# EAGLE schematic led_analog_watch_mvmt_v1_3 (EAGLE 6.2)
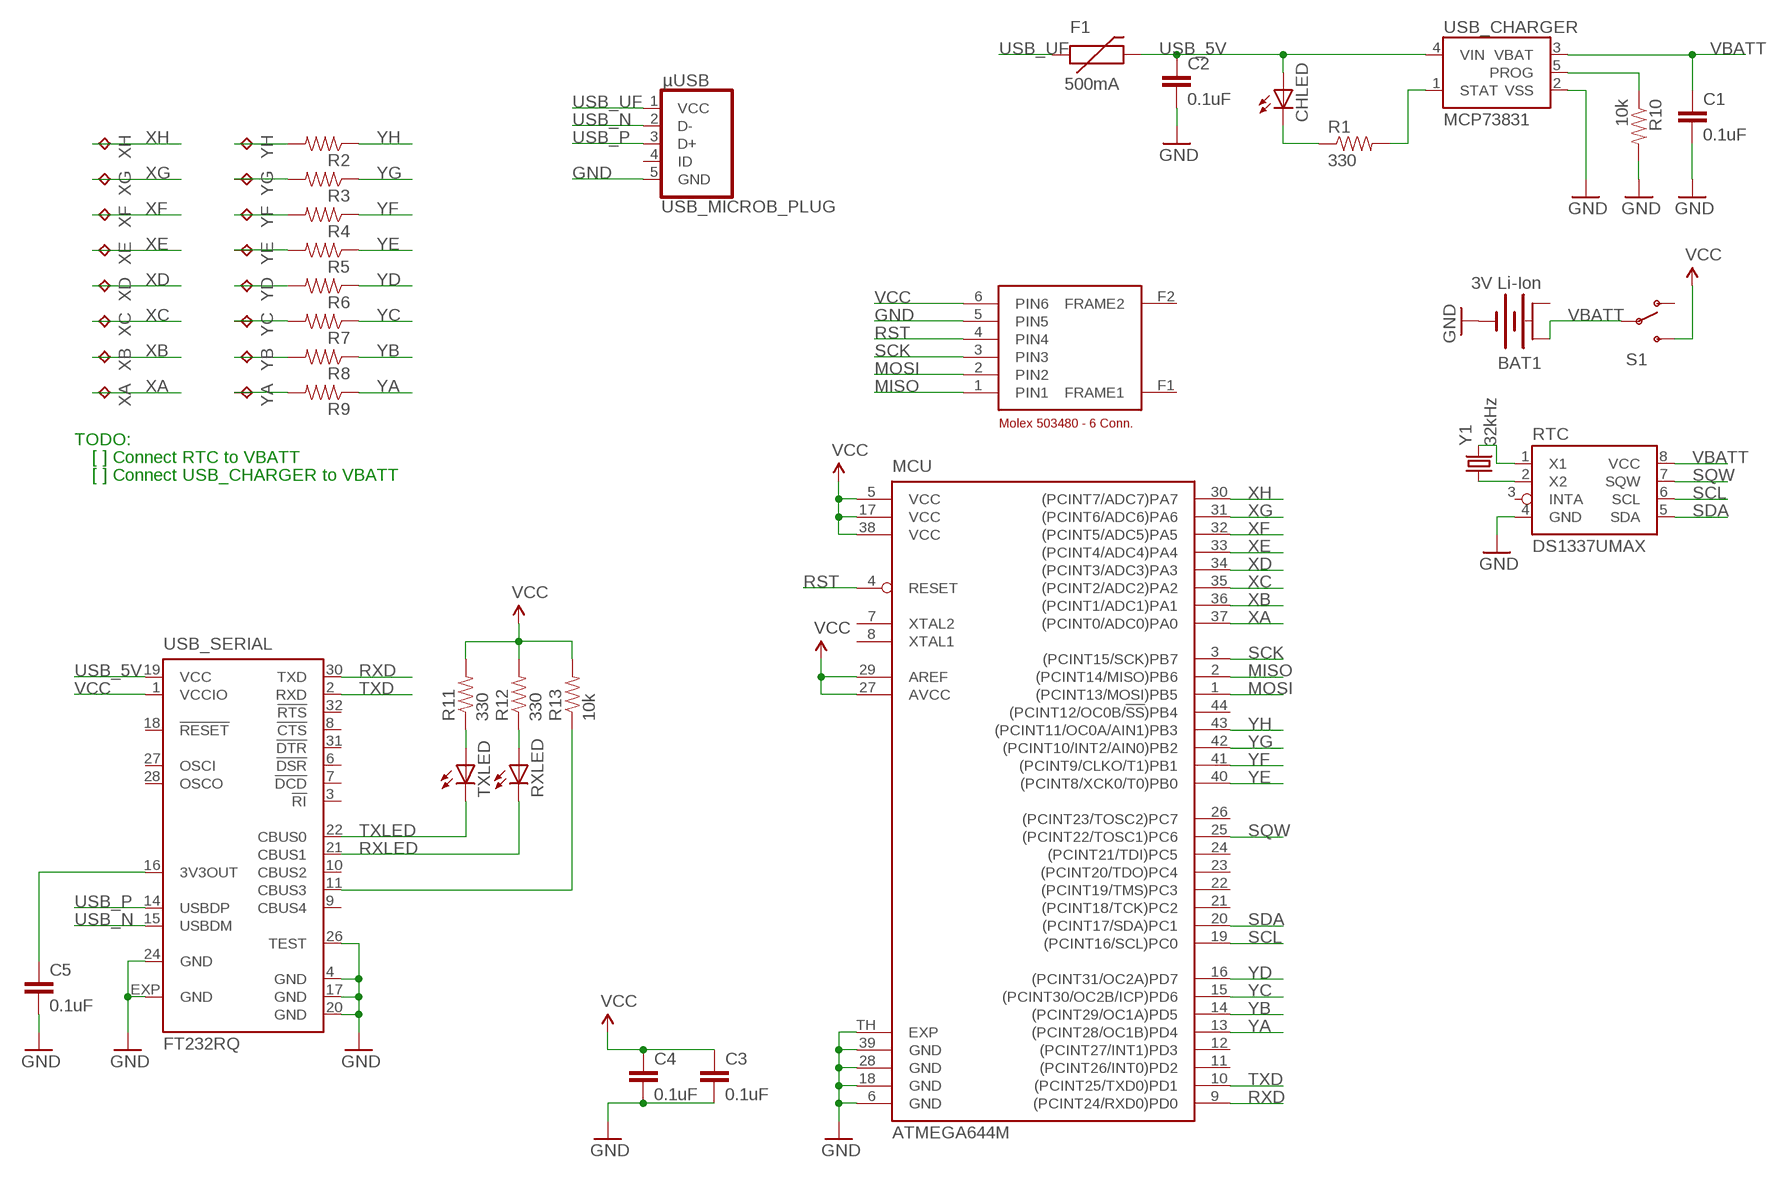
[diagram p0: schematic, sheet 1]

## Parts
BAT1  3V Li-Ion  BATTERY245PTH  [BATTCON_245MM_PTH]
C1  0.1uF  CAP-0603  [0603-CAP]
C2  0.1uF  CAP-0603  [0603-CAP]
C3  0.1uF  CAP-0603  [0603-CAP]
C4  0.1uF  CAP-0603  [0603-CAP]
C5  0.1uF  CAP-0603  [0603-CAP]
CHLED  LED-0402  [0402]
F1  500mA  PTC0603  [0603]
MCU  ATMEGA644M  [MLF44-TH]
R1  330  RESISTOR-0603  [0603]
R2  RESISTOR-0603  [0603]
R3  RESISTOR-0603  [0603]
R4  RESISTOR-0603  [0603]
R5  RESISTOR-0603  [0603]
R6  RESISTOR-0603  [0603]
R7  RESISTOR-0603  [0603]
R8  RESISTOR-0603  [0603]
R9  RESISTOR-0603  [0603]
R10  10k  RESISTOR-0603  [0603]
R11  330  RESISTOR-0603  [0603]
R12  330  RESISTOR-0603  [0603]
R13  10k  RESISTOR-0603  [0603]
RTC  DS1337UMAX  [UMAX8]
RXLED  LED-0402  [0402]
S1  SWITCH-SPSTMA12R  [SWITCH-MA12R]
TXLED  LED-0402  [0402]
U$2  MOLEX_503480  [MOLEX_503480]
USB_CHARGER  MCP73831  [SOT23-5]
USB_SERIAL  FT232RQ  [QFN32]
XA  TPTP20R  [TP20R]
XB  TPTP20R  [TP20R]
XC  TPTP20R  [TP20R]
XD  TPTP20R  [TP20R]
XE  TPTP20R  [TP20R]
XF  TPTP20R  [TP20R]
XG  TPTP20R  [TP20R]
XH  TPTP20R  [TP20R]
Y1  32kHz  CRYSTALABS10  [CRYSTAL-ABS10-SMD]
YA  TPTP20R  [TP20R]
YB  TPTP20R  [TP20R]
YC  TPTP20R  [TP20R]
YD  TPTP20R  [TP20R]
YE  TPTP20R  [TP20R]
YF  TPTP20R  [TP20R]
YG  TPTP20R  [TP20R]
YH  TPTP20R  [TP20R]
µUSB  USB_MICROB_PLUG  [USB_MICRO_B_TYCO]

## Nets
GND: BAT1.2(-) C1.2 C2.2 C3.2 C4.2 C5.2 MCU.6(GND) MCU.18(GND) MCU.28(GND) MCU.39(GND) MCU.TH(EXP) R10.2 RTC.4(GND) U$2.5(PIN5) USB_CHARGER.2(VSS) USB_SERIAL.4(GND) USB_SERIAL.17(GND) USB_SERIAL.20(GND) USB_SERIAL.24(GND) USB_SERIAL.26(TEST) USB_SERIAL.EXP(GND) µUSB.5(GND)
MISO: MCU.2((PCINT14/MISO)PB6) U$2.1(PIN1)
MOSI: MCU.1((PCINT13/MOSI)PB5) U$2.2(PIN2)
N$1: R1.2 USB_CHARGER.1(STAT)
N$2: R10.1 USB_CHARGER.5(PROG)
N$3: R2.2 YH.TP
N$4: R3.2 YG.TP
N$5: R4.2 YF.TP
N$6: R5.2 YE.TP
N$7: R6.2 YD.TP
N$8: R7.2 YC.TP
N$9: R8.2 YB.TP
N$10: R9.2 YA.TP
N$11: CHLED.2(C) R1.1
N$12: R13.1 USB_SERIAL.11(CBUS3)
N$13: R12.1 RXLED.1(A)
N$14: RTC.2(X2) Y1.X1
N$15: RTC.1(X1) Y1.X2
N$16: R11.1 TXLED.1(A)
N$18: C5.1 USB_SERIAL.16(3V3OUT)
RST: MCU.4(RESET) U$2.4(PIN4)
RXD: MCU.9((PCINT24/RXD0)PD0) USB_SERIAL.30(TXD)
RXLED: RXLED.2(C) USB_SERIAL.21(CBUS1)
SCK: MCU.3((PCINT15/SCK)PB7) U$2.3(PIN3)
SCL: MCU.19((PCINT16/SCL)PC0) RTC.6(SCL)
SDA: MCU.20((PCINT17/SDA)PC1) RTC.5(SDA)
SQW: MCU.25((PCINT22/TOSC1)PC6) RTC.7(SQW)
TXD: MCU.10((PCINT25/TXD0)PD1) USB_SERIAL.2(RXD)
TXLED: TXLED.2(C) USB_SERIAL.22(CBUS0)
USB_5V: C2.1 CHLED.1(A) F1.2 USB_CHARGER.4(VIN) USB_SERIAL.19(VCC)
USB_N: USB_SERIAL.15(USBDM) µUSB.2(D-)
USB_P: USB_SERIAL.14(USBDP) µUSB.3(D+)
USB_UF: F1.1 µUSB.1(VCC)
VBATT [supply]: BAT1.3(+A) C1.1 RTC.8(VCC) S1.2(P) USB_CHARGER.3(VBAT)
VCC: C3.1 C4.1 MCU.5(VCC) MCU.17(VCC) MCU.27(AVCC) MCU.29(AREF) MCU.38(VCC) R11.2 R12.2 R13.2 S1.3(S) U$2.6(PIN6) USB_SERIAL.1(VCCIO)
XA: MCU.37((PCINT0/ADC0)PA0) XA.TP
XB: MCU.36((PCINT1/ADC1)PA1) XB.TP
XC: MCU.35((PCINT2/ADC2)PA2) XC.TP
XD: MCU.34((PCINT3/ADC3)PA3) XD.TP
XE: MCU.33((PCINT4/ADC4)PA4) XE.TP
XF: MCU.32((PCINT5/ADC5)PA5) XF.TP
XG: MCU.31((PCINT6/ADC6)PA6) XG.TP
XH: MCU.30((PCINT7/ADC7)PA7) XH.TP
YA: MCU.13((PCINT28/OC1B)PD4) R9.1
YB: MCU.14((PCINT29/OC1A)PD5) R8.1
YC: MCU.15((PCINT30/OC2B/ICP)PD6) R7.1
YD: MCU.16((PCINT31/OC2A)PD7) R6.1
YE: MCU.40((PCINT8/XCK0/T0)PB0) R5.1
YF: MCU.41((PCINT9/CLKO/T1)PB1) R4.1
YG: MCU.42((PCINT10/INT2/AIN0)PB2) R3.1
YH: MCU.43((PCINT11/OC0A/AIN1)PB3) R2.1
Unconnected: MCU.7(XTAL2) MCU.8(XTAL1) MCU.11((PCINT26/INT0)PD2) MCU.12((PCINT27/INT1)PD3) MCU.21((PCINT18/TCK)PC2) MCU.22((PCINT19/TMS)PC3) MCU.23((PCINT20/TDO)PC4) MCU.24((PCINT21/TDI)PC5) MCU.26((PCINT23/TOSC2)PC7) MCU.44((PCINT12/OC0B/!SS!)PB4) RTC.3(INTA) S1.1(O) U$2.F1(FRAME1) U$2.F2(FRAME2) USB_SERIAL.3(!RI) USB_SERIAL.6(!DSR) USB_SERIAL.7(!DCD) USB_SERIAL.8(!CTS) USB_SERIAL.9(CBUS4) USB_SERIAL.10(CBUS2) USB_SERIAL.18(!RESET) USB_SERIAL.27(OSCI) USB_SERIAL.28(OSCO) USB_SERIAL.31(!DTR) USB_SERIAL.32(!RTS) µUSB.4(ID)

## Notes on the sheet
- TODO:
- [ ] Connect RTC to VBATT
- [ ] Connect USB_CHARGER to VBATT

## Power pins joined to a net without a drawn wire
+B: BAT1.1(+B)

## Library data of the parts
BAT1 = jcole:BATTERY: Battery Holders Various common sizes : AA, AAA, 20mm coin cell and 12mm coin cell.
C1-C5 = jcole:CAP: Capacitor Standard 0603 ceramic capacitor, and 0.1" leaded capacitor.
CHLED RXLED TXLED = jcole:LED: LEDs Standard schematic elements and footprints for 5mm, 3mm, 1206, and 0603 sized LEDs. 5mm - Spark Fun Electronics SKU : COM-00529 (and others)
F1 = SparkFun:PTC: Resettable Fuse PTC Resettable Fuse. Spark Fun Electronics SKU : COM-08357
MCU = atmel:ATMEGA644*: 8-bit Microcontroller with 64K Bytes In-System Programmable Flash Source: http://www.atmel.com/dyn/resources/prod_documents/doc2593.pdf; MPN: ATMEGA644P-20MU; OC_FARNELL: 1748528; OC_NEWARK: 26R5636
R1-R13 = jcole:RESISTOR: Resistor Basic schematic elements and footprints for 0603, 1206, and PTH resistors.
RTC = jcole:DS1337
S1 = jcole:SWITCH-SPST: SPST Switch Simple slide switch. Spark Fun Electronics SKU : COM-00102
U$2 = jcole:MOLEX_503480
USB_CHARGER = SparkFun:MCP73831: Microchip's MCP73831 Miniature single cell, fully integrated Li-Ion, Li-polymer charge management controller http://ww1.microchip.com/downloads/en/DeviceDoc/21984a.pdf
USB_SERIAL = jcole:FT232R: Source: http://www.ftdichip.com/Documents/DataSheets/DS_FT232R_v104.pdf; MPN: FT232RQ; OC_FARNELL: 1146033; OC_NEWARK: 91K9919
XA XB XC XD XE XF XG XH YA YB YC YD YE YF YG YH = testpad:TP: Test pad
Y1 = jcole:CRYSTAL: Crystals Various standard crystals. Proven footprints. Spark Fun Electronics SKU : COM-00534
µUSB = jcole:USB_MICROB_PLUG: USB Micro-B Plug Comes in a variety of packages. Check out Hirose's ZX-x0 line: http://www.hirose.co.jp/cataloge_hp/e24200011.pdf

## Net classes
0 signal: width 0.203 mm
1 supply: width 0.305 mm